# Altium project PCB_Project.PrjPcb (part 10 of 10)
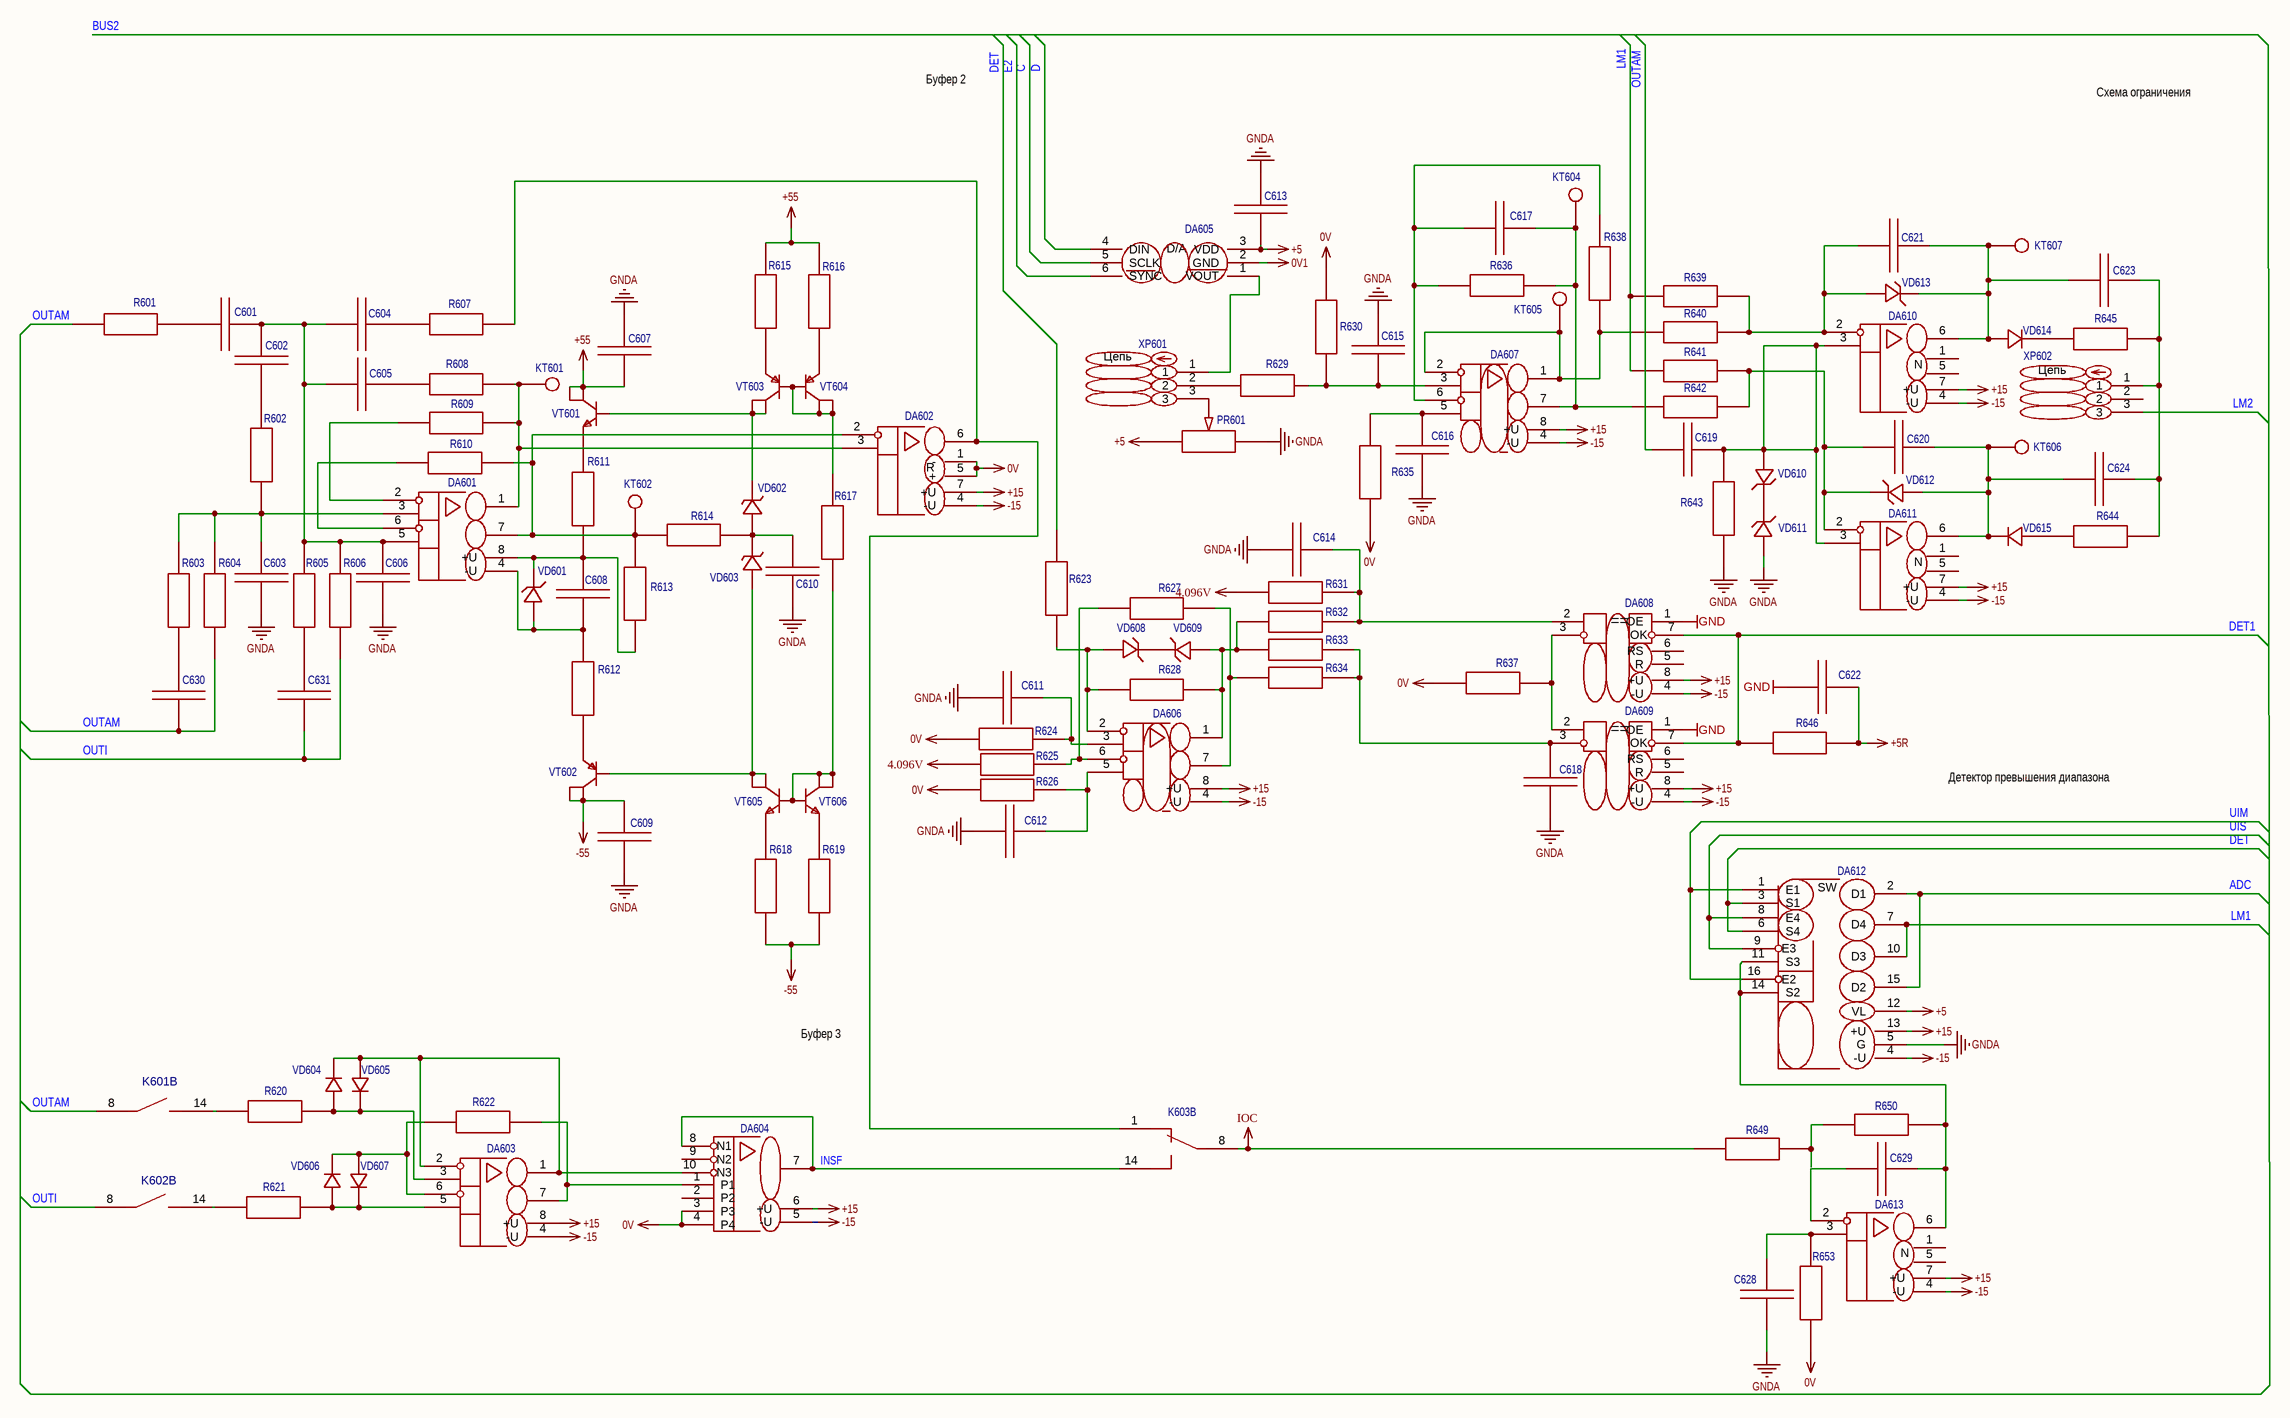
[diagram p12: УШЯИ.411618.029Э Э3 Лист 7.schdoc]

## Sheet УШЯИ.411618.029Э Э3 Лист 7.schdoc (continued)

### Library data of the parts (continued)
VT601 = Транзистор DZTA42 NPN [SOT223]: Manufacturer: DIODES(美台); Manufacturer Part: DZTA42-13; Contributor: LCSC; Convert to PCB: yes; UniqueId: ggee8784702b1a698a4; Origin Footprint: SOT-223-4_L6.5-W3.5-P2.30-LS7.0-BR; Device: Транзистор DZTA42 NPN [SOT223]; Symbol: Транзистор DZTA42 NPN [SOT223]; Supplier: LCSC; Supplier Part: C531150; JLCPCB Part Class: Extended Part; spicePre: Q; spiceSymbolName: DZTA42-13; Add into BOM: yes; FootprintName: SOT-223-4_L6.5-W3.5-P2.30-LS7.0-BR
VT602 = Транзистор DZTA92 PNP [SOT223]: Manufacturer: DIODES(美台); Manufacturer Part: DZTA92-13; Contributor: lcsc; Convert to PCB: yes; UniqueId: gge8e252b743bdca2c7; Origin Footprint: SOT-223-3_L6.5-W3.4-P2.30-LS7.0-BR; Device: Транзистор DZTA92 PNP [SOT223]; Symbol: Транзистор DZTA92 PNP [SOT223]; Supplier: LCSC; Supplier Part: C5205190; JLCPCB Part Class: Extended Part; spicePre: Q; spiceSymbolName: DZTA92-13; Add into BOM: yes; FootprintName: SOT-223-3_L6.5-W3.4-P2.30-LS7.0-BR
VT603 = Транзистор DZTA92 PNP [SOT223]: Manufacturer: DIODES(美台); Manufacturer Part: DZTA92-13; Contributor: lcsc; Convert to PCB: yes; UniqueId: gge70e9723529a33d49; Origin Footprint: SOT-223-3_L6.5-W3.4-P2.30-LS7.0-BR; Device: Транзистор DZTA92 PNP [SOT223]; Symbol: Транзистор DZTA92 PNP [SOT223]; Supplier: LCSC; Supplier Part: C5205190; JLCPCB Part Class: Extended Part; spicePre: Q; spiceSymbolName: DZTA92-13; Add into BOM: yes; FootprintName: SOT-223-3_L6.5-W3.4-P2.30-LS7.0-BR
VT604 = Транзистор DZTA92 PNP [SOT223]: Manufacturer: DIODES(美台); Manufacturer Part: DZTA92-13; Contributor: lcsc; Convert to PCB: yes; UniqueId: gged4d98d5ae7085970; Origin Footprint: SOT-223-3_L6.5-W3.4-P2.30-LS7.0-BR; Device: Транзистор DZTA92 PNP [SOT223]; Symbol: Транзистор DZTA92 PNP [SOT223]; Supplier: LCSC; Supplier Part: C5205190; JLCPCB Part Class: Extended Part; spicePre: Q; spiceSymbolName: DZTA92-13; Add into BOM: yes; FootprintName: SOT-223-3_L6.5-W3.4-P2.30-LS7.0-BR
VT605 = Транзистор DZTA42 NPN [SOT223]: Manufacturer: DIODES(美台); Manufacturer Part: DZTA42-13; Contributor: LCSC; Convert to PCB: yes; UniqueId: gge1d3acb0be4d2ba24; Origin Footprint: SOT-223-4_L6.5-W3.5-P2.30-LS7.0-BR; Device: Транзистор DZTA42 NPN [SOT223]; Symbol: Транзистор DZTA42 NPN [SOT223]; Supplier: LCSC; Supplier Part: C531150; JLCPCB Part Class: Extended Part; spicePre: Q; spiceSymbolName: DZTA42-13; Add into BOM: yes; FootprintName: SOT-223-4_L6.5-W3.5-P2.30-LS7.0-BR
VT606 = Транзистор DZTA42 NPN [SOT223]: Manufacturer: DIODES(美台); Manufacturer Part: DZTA42-13; Contributor: LCSC; Convert to PCB: yes; UniqueId: gge568e4d089094a941; Origin Footprint: SOT-223-4_L6.5-W3.5-P2.30-LS7.0-BR; Device: Транзистор DZTA42 NPN [SOT223]; Symbol: Транзистор DZTA42 NPN [SOT223]; Supplier: LCSC; Supplier Part: C531150; JLCPCB Part Class: Extended Part; spicePre: Q; spiceSymbolName: DZTA42-13; Add into BOM: yes; FootprintName: SOT-223-4_L6.5-W3.5-P2.30-LS7.0-BR
XP601 = Вилка на плату 826629-3 шаг 2.54мм: Manufacturer: TE Connectivity; Contributor: jordanjin; Convert to PCB: yes; UniqueId: gge545ccd5247932dd5; Origin Footprint: HDR-TH_3P-P2.54-V-M-1; Device: Вилка на плату 826629-3 шаг 2.54мм; Symbol: Вилка на плату 826629-3 шаг 2.54мм; Supplier: LCSC; Manufacturer Part: 826629-3; JLCPCB Part Class: Extended Part; spicePre: X; spiceSymbolName: Вилка на плату 826629-3 шаг 2.54мм; Add into BOM: yes; FootprintName: HDR-TH_3P-P2.54-V-M-1
XP602 = Вилка на плату 826629-3 шаг 2.54мм: Manufacturer: TE Connectivity; Contributor: jordanjin; Convert to PCB: yes; UniqueId: ggefae9065540a3e46c; Origin Footprint: HDR-TH_3P-P2.54-V-M-1; Device: Вилка на плату 826629-3 шаг 2.54мм; Symbol: Вилка на плату 826629-3 шаг 2.54мм; Supplier: LCSC; Manufacturer Part: 826629-3; JLCPCB Part Class: Extended Part; spicePre: X; spiceSymbolName: Вилка на плату 826629-3 шаг 2.54мм; Add into BOM: yes; FootprintName: HDR-TH_3P-P2.54-V-M-1

## Nets that join several sheets
0V: УШЯИ.411618.029Э Э3 Лист 3 (9 pins), УШЯИ.411618.029Э Э3 Лист 4 (R302.1 VD301.1 VD302.2), УШЯИ.411618.029Э Э3 Лист 6 (C517.2 R505.1 R519.1 R527.1), УШЯИ.411618.029Э Э3 Лист 7 (10 pins)
4.096V: УШЯИ.411618.029Э Э3 Лист 3 (6 pins), УШЯИ.411618.029Э Э3 Лист 7 (R625.1 R631.1)
+5: УШЯИ.411618.029Э Э3 Лист 2 (7 pins), УШЯИ.411618.029Э Э3 Лист 3 (DA204.12 DA206.12 DA210.3 R229.1), УШЯИ.411618.029Э Э3 Лист 4 (R313.1 R318.1 VD306.2), УШЯИ.411618.029Э Э3 Лист 6 (DA503.12 DA505.12 R531.1), УШЯИ.411618.029Э Э3 Лист 7 (C613.1 DA605.3 DA612.12 PR601.3)
+5R: УШЯИ.411618.029Э Э3 Лист 2 (28 pins), УШЯИ.411618.029Э Э3 Лист 3 (DA211.9 DA211.10 DA212.14), УШЯИ.411618.029Э Э3 Лист 7 (C622.2 R646.2)
+15: УШЯИ.411618.029Э Э3 Лист 3 (9 pins), УШЯИ.411618.029Э Э3 Лист 6 (DA502.7 DA503.13 DA504.7 DA505.13), УШЯИ.411618.029Э Э3 Лист 7 (11 pins)
+55: УШЯИ.411618.029Э Э3 Лист 4 (8 pins), УШЯИ.411618.029Э Э3 Лист 6 (6 pins), УШЯИ.411618.029Э Э3 Лист 7 (5 pins)
-15: УШЯИ.411618.029Э Э3 Лист 3 (DA204.4 DA205.13 DA206.4 DA207.4), УШЯИ.411618.029Э Э3 Лист 6 (DA502.4 DA503.4 DA504.4 DA505.4), УШЯИ.411618.029Э Э3 Лист 7 (11 pins)
-55: УШЯИ.411618.029Э Э3 Лист 4 (8 pins), УШЯИ.411618.029Э Э3 Лист 6 (6 pins), УШЯИ.411618.029Э Э3 Лист 7 (5 pins)
GND: УШЯИ.411618.029Э Э3 Лист 1 (59 pins), УШЯИ.411618.029Э Э3 Лист 2 (55 pins), УШЯИ.411618.029Э Э3 Лист 3 (DA205.3 DA212.7 DA212.12), УШЯИ.411618.029Э Э3 Лист 6 (R533.1 VT509.2), УШЯИ.411618.029Э Э3 Лист 7 (C622.1 DA608.1 DA609.1)
GNDA: УШЯИ.411618.029Э Э3 Лист 3 (20 pins), УШЯИ.411618.029Э Э3 Лист 4 (15 pins), УШЯИ.411618.029Э Э3 Лист 6 (20 pins), УШЯИ.411618.029Э Э3 Лист 7 (17 pins)
GRD: УШЯИ.411618.029Э Э3 Лист 5 (7 pins), УШЯИ.411618.029Э Э3 Лист 6 (6 pins)
IOC: УШЯИ.411618.029Э Э3 Лист 3 (C211.1 R213.1), УШЯИ.411618.029Э Э3 Лист 7 (K603.8 R649.2)
NV: УШЯИ.411618.029Э Э3 Лист 5 (13 pins), УШЯИ.411618.029Э Э3 Лист 6 (6 pins)
PR: УШЯИ.411618.029Э Э3 Лист 4 (5 pins), УШЯИ.411618.029Э Э3 Лист 6 (K502.14)
UOC: УШЯИ.411618.029Э Э3 Лист 3 (XP201.1), УШЯИ.411618.029Э Э3 Лист 6 (8 pins)
VDD: УШЯИ.411618.029Э Э3 Лист 1 (52 pins), УШЯИ.411618.029Э Э3 Лист 2 (15 pins)
3/50V: УШЯИ.411618.029Э Э3 Лист 1 (DD113.6), УШЯИ.411618.029Э Э3 Лист 2 (DD114.29)
102: УШЯИ.411618.029Э Э3 Лист 1 (VD102.1), УШЯИ.411618.029Э Э3 Лист 2 (DD114.17)
103: УШЯИ.411618.029Э Э3 Лист 1 (VD103.1), УШЯИ.411618.029Э Э3 Лист 2 (DD114.19)
104: УШЯИ.411618.029Э Э3 Лист 1 (VD104.1), УШЯИ.411618.029Э Э3 Лист 2 (DD114.20)
105: УШЯИ.411618.029Э Э3 Лист 1 (VD105.1), УШЯИ.411618.029Э Э3 Лист 2 (DD114.21)
106: УШЯИ.411618.029Э Э3 Лист 1 (VD106.1), УШЯИ.411618.029Э Э3 Лист 2 (DD114.22)
107: УШЯИ.411618.029Э Э3 Лист 1 (VD107.1), УШЯИ.411618.029Э Э3 Лист 2 (DD114.23)
108: УШЯИ.411618.029Э Э3 Лист 1 (VD108.1), УШЯИ.411618.029Э Э3 Лист 2 (DD114.24)
109: УШЯИ.411618.029Э Э3 Лист 1 (VD109.1), УШЯИ.411618.029Э Э3 Лист 2 (DD114.25)
+U: УШЯИ.411618.029Э Э3 Лист 2 (DD114.77), УШЯИ.411618.029Э Э3 Лист 4 (R311.1)
-U: УШЯИ.411618.029Э Э3 Лист 2 (DD114.76), УШЯИ.411618.029Э Э3 Лист 4 (R319.1)
ADC: УШЯИ.411618.029Э Э3 Лист 3 (R221.2), УШЯИ.411618.029Э Э3 Лист 7 (DA612.2 DA612.15)
AZ: УШЯИ.411618.029Э Э3 Лист 2 (DD114.50), УШЯИ.411618.029Э Э3 Лист 6 (DA503.8 DA503.9)
C: УШЯИ.411618.029Э Э3 Лист 1 (DD102.3), УШЯИ.411618.029Э Э3 Лист 2 (DD114.31), УШЯИ.411618.029Э Э3 Лист 3 (DA205.7)
CA: УШЯИ.411618.029Э Э3 Лист 1 (DD107.3), УШЯИ.411618.029Э Э3 Лист 3 (DA212.1 DA212.2)
D: УШЯИ.411618.029Э Э3 Лист 1 (DD101.3), УШЯИ.411618.029Э Э3 Лист 2 (DD114.30), УШЯИ.411618.029Э Э3 Лист 3 (DA205.4)
DA: УШЯИ.411618.029Э Э3 Лист 1 (DD108.6), УШЯИ.411618.029Э Э3 Лист 3 (DA212.6)
DET: УШЯИ.411618.029Э Э3 Лист 2 (DD114.45), УШЯИ.411618.029Э Э3 Лист 6 (C518.2 DA504.6 KT503.1 R528.1), УШЯИ.411618.029Э Э3 Лист 7 (R623.1)
DET1: УШЯИ.411618.029Э Э3 Лист 2 (DD114.2), УШЯИ.411618.029Э Э3 Лист 7 (DA608.7 DA609.7 R646.1)
E1: УШЯИ.411618.029Э Э3 Лист 1 (DD103.6), УШЯИ.411618.029Э Э3 Лист 3 (DA205.5)
ER: УШЯИ.411618.029Э Э3 Лист 1 (DD105.6), УШЯИ.411618.029Э Э3 Лист 2 (DD114.32)
IMPI: УШЯИ.411618.029Э Э3 Лист 1 (DD110.3), УШЯИ.411618.029Э Э3 Лист 3 (DA206.8 DA206.9)
IMPV: УШЯИ.411618.029Э Э3 Лист 1 (DD109.6), УШЯИ.411618.029Э Э3 Лист 3 (DA205.9)
INAM: УШЯИ.411618.029Э Э3 Лист 3 (K201#2.8 R209.2), УШЯИ.411618.029Э Э3 Лист 4 (5 pins), УШЯИ.411618.029Э Э3 Лист 6 (DA503.7 DA503.10)
LIM: УШЯИ.411618.029Э Э3 Лист 1 (DD112.6), УШЯИ.411618.029Э Э3 Лист 2 (DD114.28)
LM1: УШЯИ.411618.029Э Э3 Лист 2 (DD114.41), УШЯИ.411618.029Э Э3 Лист 7 (DA612.7 DA612.10 R639.1 R641.1)
LM2: УШЯИ.411618.029Э Э3 Лист 2 (DD114.40), УШЯИ.411618.029Э Э3 Лист 6 (DA503.6), УШЯИ.411618.029Э Э3 Лист 7 (XP602.3)
OUTAM: УШЯИ.411618.029Э Э3 Лист 3 (XP201.3), УШЯИ.411618.029Э Э3 Лист 4 (10 pins), УШЯИ.411618.029Э Э3 Лист 5 (17 pins), УШЯИ.411618.029Э Э3 Лист 6 (C514.1 R520.2), УШЯИ.411618.029Э Э3 Лист 7 (5 pins)
OUTI: УШЯИ.411618.029Э Э3 Лист 5 (5 pins), УШЯИ.411618.029Э Э3 Лист 7 (C631.1 K602#2.8 R606.1)
OVLB: УШЯИ.411618.029Э Э3 Лист 1 (DD111.6), УШЯИ.411618.029Э Э3 Лист 2 (DD114.27)
RN: УШЯИ.411618.029Э Э3 Лист 1 (DD106.3), УШЯИ.411618.029Э Э3 Лист 3 (DA212.9 DA212.10)
ST1: УШЯИ.411618.029Э Э3 Лист 2 (DD114.58), УШЯИ.411618.029Э Э3 Лист 3 (DA204.1)
ST2: УШЯИ.411618.029Э Э3 Лист 2 (DD114.57), УШЯИ.411618.029Э Э3 Лист 3 (DA204.8)
ST3: УШЯИ.411618.029Э Э3 Лист 2 (DD114.56), УШЯИ.411618.029Э Э3 Лист 3 (DA204.9)
ST4: УШЯИ.411618.029Э Э3 Лист 2 (DD114.60), УШЯИ.411618.029Э Э3 Лист 3 (DA206.1 DA206.16)
U1: УШЯИ.411618.029Э Э3 Лист 2 (DD114.49), УШЯИ.411618.029Э Э3 Лист 6 (DA505.1)
U2: УШЯИ.411618.029Э Э3 Лист 2 (DD114.48), УШЯИ.411618.029Э Э3 Лист 6 (DA505.8)
U3: УШЯИ.411618.029Э Э3 Лист 2 (DD114.47), УШЯИ.411618.029Э Э3 Лист 6 (DA505.9)
U4: УШЯИ.411618.029Э Э3 Лист 2 (DD114.52), УШЯИ.411618.029Э Э3 Лист 6 (DA503.1 DA503.16)